# Altium schematic sheet FET.SchDoc (part 1 of 2)
size 420 x 297 mm; Date: 28.05.2024; ApprovedBy: Arda B.; CheckedBy: Arda B.; DrawnBy: Arda Bozkurt; Revision: 001; SheetNumber: 5; SheetTotal: 5; Department: HDD; Size: A3; Time: 28.05.2024
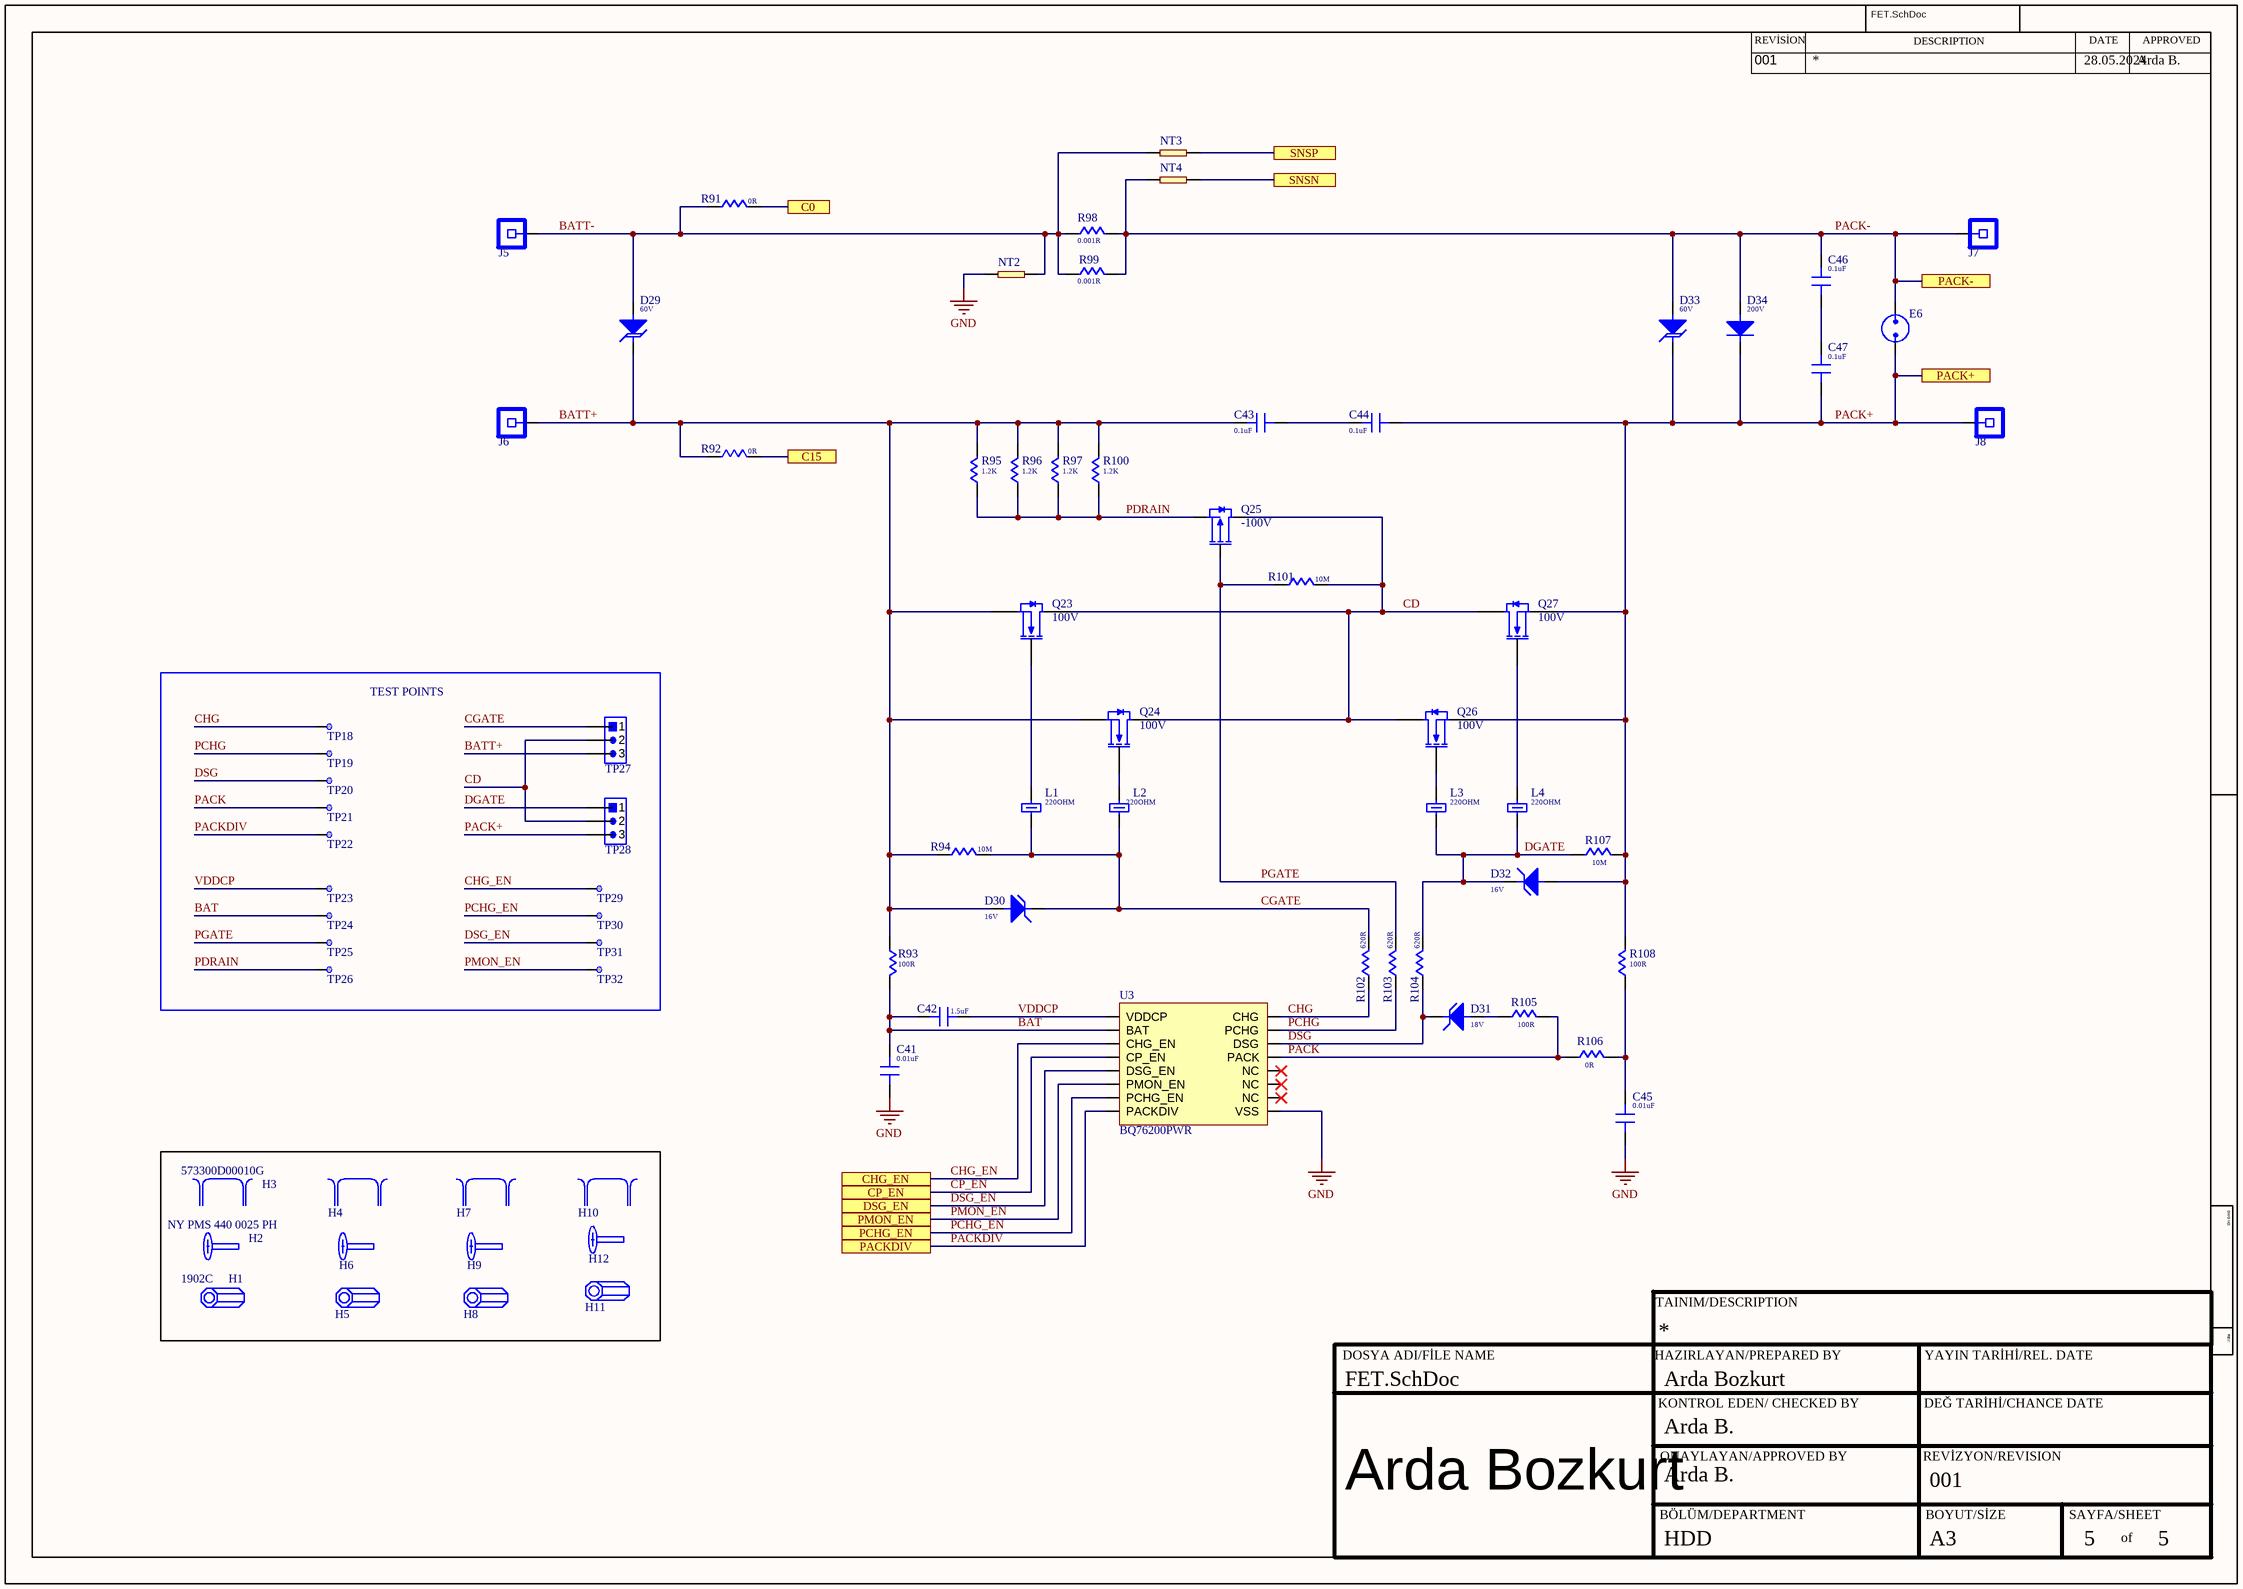
[diagram p0: FET.SchDoc]

## Parts
C41  value 0.01uF  [C_0805]  (hidden comment: KGM21NR72A103KT)
C42  value 1.5uF  [C_0805]  (hidden comment: GRM21BR71E155KA88L)
C43  value 0.1uF  [C_0603]  (hidden comment: GRM188R72A104KA35D)
C44  value 0.1uF  [C_0603]  (hidden comment: GRM188R72A104KA35D)
C45  value 0.01uF  [C_0805]  (hidden comment: KGM21NR72A103KT)
C46  value 0.1uF  [C_0603]  (hidden comment: GRM188R72A104KA35D)
C47  value 0.1uF  [C_0603]  (hidden comment: GRM188R72A104KA35D)
D29  value 60V  [D_SMC]  (hidden comment: SMCJ60A)
D30  value 16V  [D_SOD323]  (hidden comment: MMSZ5246BS-7-F)
D31  value 18V  [D_SOD323]  (hidden comment: MMSZ5248BS-7-F)
D32  value 16V  [D_SOD323]  (hidden comment: MMSZ5246BS-7-F)
D33  value 60V  [D_SMC]  (hidden comment: SMCJ60A)
D34  value 200V  [D_DO214AB]  (hidden comment: ES3D-E3/57T)
E6  SPARKGAP  [SPARK_GARP]  (value not drawn)
H1  1902C  [HEX_STANDOFF]
H2  NY PMS 440 0025 PH  [PEN]
H3  573300D00010G  [HEATSINK]
H4  573300D00010G  [HEATSINK]  (value not drawn)
H5  1902C  [HEX_STANDOFF]  (value not drawn)
H6  NY PMS 440 0025 PH  [PEN]  (value not drawn)
H7  573300D00010G  [HEATSINK]  (value not drawn)
H8  1902C  [HEX_STANDOFF]  (value not drawn)
H9  NY PMS 440 0025 PH  [PEN]  (value not drawn)
H10  573300D00010G  [HEATSINK]  (value not drawn)
H11  1902C  [HEX_STANDOFF]  (value not drawn)
H12  NY PMS 440 0025 PH  [PEN]  (value not drawn)
J5  ML4-CY  [CONN_LUG]  (value not drawn)
J6  ML4-CY  [CONN_LUG]  (value not drawn)
J7  ML4-CY  [CONN_LUG]  (value not drawn)
J8  ML4-CY  [CONN_LUG]  (value not drawn)
L1  value 220OHM  [L_0603]  (hidden comment: BLM18SG221TN1D)
L2  value 220OHM  [L_0603]  (hidden comment: BLM18SG221TN1D)
L3  value 220OHM  [L_0603]  (hidden comment: BLM18SG221TN1D)
L4  value 220OHM  [L_0603]  (hidden comment: BLM18SG221TN1D)
NT2  NET Tie  [NET_TİE_2]  (value not drawn)  (net tie)
NT3  NET Tie  [NET_TİE_3]  (value not drawn)  (net tie)
NT4  NET Tie  [NET_TİE_3]  (value not drawn)  (net tie)
Q23  Voltage: 100V  [Q_DDPAK]  (hidden comment: CSD19536KTT)
Q24  Voltage: 100V  [Q_DDPAK]  (hidden comment: CSD19536KTT)
Q25  Voltage Rating (DC): -100V  [Q_SOT23-3]  (hidden comment: ZXMP10A13FTA)
Q26  Voltage: 100V  [Q_DDPAK]  (hidden comment: CSD19536KTT)
Q27  Voltage: 100V  [Q_DDPAK]  (hidden comment: CSD19536KTT)
R91  value 0R  [R_0603]  (hidden comment: CRCW06030000Z0EA)
R92  value 0R  [R_0603]  (hidden comment: CRCW06030000Z0EA)
R93  value 100R  [R_0603]  (hidden comment: CRCW0603100RFKEA)
R94  value 10M  [R_0603]  (hidden comment: CRCW060310M0FKEA)
R95  value 1.2K  [R_2512]  (hidden comment: CRCW25121K20JNEG)
R96  value 1.2K  [R_2512]  (hidden comment: CRCW25121K20JNEG)
R97  value 1.2K  [R_2512]  (hidden comment: CRCW25121K20JNEG)
R98  value 0.001R  [R_2010]  (hidden comment: CSNL2010FT1L00)
R99  value 0.001R  [R_2010]  (hidden comment: CSNL2010FT1L00)
R100  value 1.2K  [R_2512]  (hidden comment: CRCW25121K20JNEG)
R101  value 10M  [R_0603]  (hidden comment: CRCW060310M0FKEA)
R102  value 620R  [R_0603]  (hidden comment: CRCW0603620RJNEA)
R103  value 620R  [R_0603]  (hidden comment: CRCW0603620RJNEA)
R104  value 620R  [R_0603]  (hidden comment: CRCW0603620RJNEA)
R105  value 100R  [R_0603]  (hidden comment: CRCW0603100RJNEA)
R106  value 0R  [R_0603]  (hidden comment: CRCW06030000Z0EA)
R107  value 10M  [R_0603]  (hidden comment: CRCW060310M0FKEA)
R108  value 100R  [R_0603]  (hidden comment: CRCW0603100RFKEA)
TP18  5011  [TP_VİA]  (value not drawn)
TP19  5011  [TP_VİA]  (value not drawn)
TP20  5011  [TP_VİA]  (value not drawn)
TP21  5011  [TP_VİA]  (value not drawn)
TP22  5011  [TP_VİA]  (value not drawn)
TP23  5011  [TP_VİA]  (value not drawn)
TP24  5011  [TP_VİA]  (value not drawn)
TP25  5011  [TP_VİA]  (value not drawn)
TP26  5011  [TP_VİA]  (value not drawn)
TP27  PEC03SAAN  [TP_3POS]  (value not drawn)
TP28  PEC03SAAN  [TP_3POS]  (value not drawn)
TP29  5011  [TP_VİA]  (value not drawn)
TP30  5011  [TP_VİA]  (value not drawn)
TP31  5011  [TP_VİA]  (value not drawn)
TP32  5011  [TP_VİA]  (value not drawn)
U3  BQ76200PWR  [16TSSOP]

## Blocks framed on the sheet
TEST POINTS: TP18-TP32

## Ports
C0 (see AFE[11B]), C15 (see AFE[11I], GUAGE[2A]), CHG_EN (see AFE[7C]), CP_EN (see GUAGE[5B]), DSG_EN (see AFE[7C]), PACK+ (see AFE[4I]), PACK- (see GUAGE[1C], GUAGE[2D]), PACKDIV (see GUAGE[3A]), PCHG_EN (see GUAGE[5B]), PMON_EN (see GUAGE[5B]), SNSN (see AFE[8B]), SNSP (see AFE[9B])

## Nets
GND: C41.1 C45.1 NT2.1 U3.9(VSS)
BAT: C41.2 C42.1 R93.2 TP24.1 U3.2(BAT)
BATT+: C43.2 D29.1 D30.2 J6.1 Q23.3(S) Q24.3(S) R92.1 R93.1 R94.1 R95.2 R96.2 R97.2 R100.2 TP27.3
BATT-: D29.2 J5.1 NT2.2 NT3.1 R91.1 R98.1 R99.1
C0: R91.2 ; port C0
C15: R92.2 ; port C15
CD: Q23.2(D) Q24.2(D) Q25.2(S) Q26.2(D) Q27.2(D) R101.2 TP27.2 TP28.2
CGATE: D30.1 L1.1 L2.1 R94.2 R102.2 TP27.1
CHG: R102.1 TP18.1 U3.16(CHG)
CHG_EN: TP29.1 U3.4(CHG_EN) ; port CHG_EN
CP_EN: U3.5(CP_EN) ; port CP_EN
DGATE: D32.1 L3.1 L4.1 R104.2 R107.1 TP28.1
DSG: D31.1 R104.1 TP20.1 U3.12(DSG)
DSG_EN: TP31.1 U3.6(DSG_EN) ; port DSG_EN
PACK: R105.2 R106.1 TP21.1 U3.11(PACK)
PACK+: C44.1 C47.1 D32.2 D33.1 D34.1 E6.1 J8.1 Q26.3(S) Q27.3(S) R107.2 R108.2 TP28.3 ; port PACK+
PACK-: C46.2 D33.2 D34.2 E6.2 J7.1 NT4.1 R98.2 R99.2 ; port PACK-
PACKDIV: TP22.1 U3.10(PACKDIV) ; port PACKDIV
PCHG: R103.1 TP19.1 U3.14(PCHG)
PCHG_EN: TP30.1 U3.8(PCHG_EN) ; port PCHG_EN
PDRAIN: Q25.3(D) R95.1 R96.1 R97.1 R100.1 TP26.1
PGATE: Q25.1(G) R101.1 R103.2 TP25.1
PMON_EN: TP32.1 U3.7(PMON_EN) ; port PMON_EN
SNSN: NT4.2 ; port SNSN
SNSP: NT3.2 ; port SNSP
VDDCP: C42.2 TP23.1 U3.1(VDDCP)
NetC43_1: C43.1 C44.2
NetC45_2: C45.2 R106.2 R108.1
NetC46_1: C46.1 C47.2
NetD31_2: D31.2 R105.1
NetL1_2: L1.2 Q23.1(G)
NetL2_2: L2.2 Q24.1(G)
NetL3_2: L3.2 Q26.1(G)
NetL4_2: L4.2 Q27.1(G)

Not connected (* = marked no-connect by the designer): U3 3(NC)* 13(NC)* 15(NC)*

## Notes on the sheet
- REVİSİON
- DESCRIPTION
- DATE
- APPROVED
- DWG NO:
- TAINIM/DESCRIPTION
- REV:
- DOSYA ADI/FİLE NAME
- HAZIRLAYAN/PREPARED BY
- KONTROL EDEN/ CHECKED BY
- YAYIN TARİHİ/REL. DATE
- DEĞ TARİHİ/CHANCE DATE
- ONAYLAYAN/APPROVED BY
- REVİZYON/REVISION
- Arda Bozkurt
- BÖLÜM/DEPARTMENT
- BOYUT/SİZE
- SAYFA/SHEET
- of